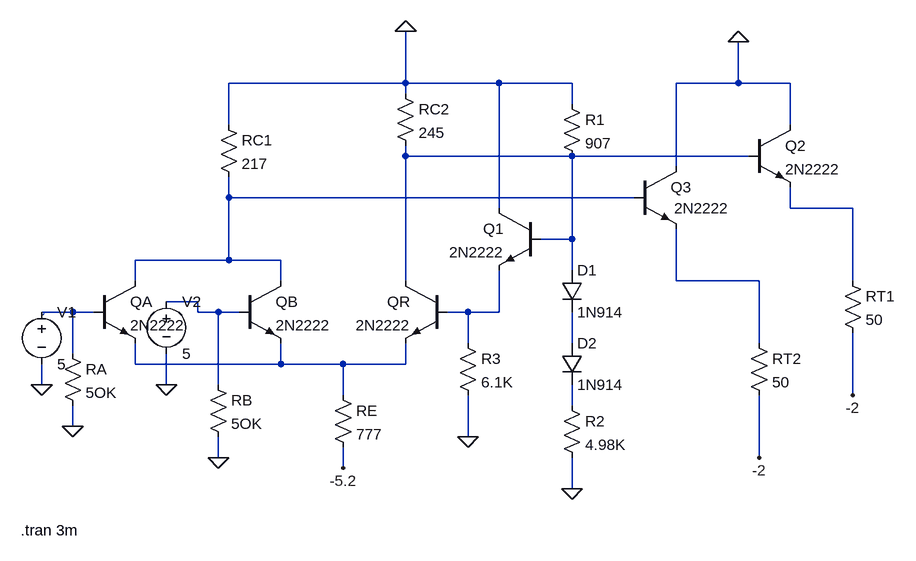
[diagram p0: schematic ECL22.asc]
ECL22.asc, the LTspice schematic file:
Version 4
SHEET 1 980 736
WIRE 192 32 192 -48
WIRE 192 32 -80 32
WIRE 336 32 192 32
WIRE 448 32 336 32
WIRE 704 32 704 -32
WIRE 704 32 608 32
WIRE 784 32 704 32
WIRE 192 48 192 32
WIRE 448 64 448 32
WIRE -80 96 -80 32
WIRE 784 96 784 32
WIRE 192 144 192 128
WIRE 448 144 192 144
WIRE 720 144 448 144
WIRE 608 160 608 32
WIRE -80 208 -80 176
WIRE 544 208 -80 208
WIRE 336 224 336 32
WIRE 784 224 784 192
WIRE 880 224 784 224
WIRE 448 272 448 144
WIRE 448 272 400 272
WIRE -80 304 -80 208
WIRE -80 304 -224 304
WIRE 0 304 -80 304
WIRE 448 320 448 272
WIRE -224 336 -224 304
WIRE 0 336 0 304
WIRE 192 336 192 144
WIRE 608 336 608 256
WIRE 736 336 608 336
WIRE 880 336 880 224
WIRE -128 368 -176 368
WIRE -320 384 -368 384
WIRE -288 384 -320 384
WIRE -128 384 -128 368
WIRE -96 384 -128 384
WIRE -64 384 -96 384
WIRE 288 384 256 384
WIRE 336 384 336 320
WIRE 336 384 288 384
WIRE 288 432 288 384
WIRE 448 432 448 384
WIRE 736 432 736 336
WIRE -320 448 -320 384
WIRE -224 464 -224 432
WIRE 0 464 0 432
WIRE 0 464 -224 464
WIRE 96 464 0 464
WIRE 192 464 192 432
WIRE 192 464 96 464
WIRE -368 496 -368 464
WIRE -176 496 -176 448
WIRE -96 496 -96 384
WIRE 96 512 96 464
WIRE 880 512 880 416
WIRE 448 528 448 496
WIRE -320 560 -320 528
WIRE 288 576 288 512
WIRE -96 608 -96 576
WIRE 736 608 736 512
WIRE 96 624 96 592
WIRE 448 656 448 608
FLAG 448 656 0
FLAG 736 608 -2
FLAG 880 512 -2
FLAG 288 576 0
FLAG 96 624 -5.2
FLAG -96 608 0
FLAG -320 560 0
FLAG 192 -48 0
FLAG 704 -32 0
FLAG -368 496 0
FLAG -176 496 0
SYMBOL diode 432 320 R0
SYMATTR InstName D1
SYMATTR Value 1N914
SYMBOL diode 432 432 R0
SYMATTR InstName D2
SYMATTR Value 1N914
SYMBOL res 432 512 R0
SYMATTR InstName R2
SYMATTR Value 4.98K
SYMBOL res 432 48 R0
SYMATTR InstName R1
SYMATTR Value 907
SYMBOL npn 544 160 R0
WINDOW 3 61 64 Left 2
SYMATTR Value 2N2222
SYMATTR InstName Q3
SYMBOL npn 720 96 R0
SYMATTR InstName Q2
SYMATTR Value 2N2222
SYMBOL npn -288 336 R0
SYMATTR InstName QA
SYMATTR Value 2N2222
SYMBOL npn -64 336 R0
SYMATTR InstName QB
SYMATTR Value 2N2222
SYMBOL npn 256 336 M0
SYMATTR InstName QR
SYMATTR Value 2N2222
SYMBOL npn 400 224 M0
SYMATTR InstName Q1
SYMATTR Value 2N2222
SYMBOL res 80 496 R0
SYMATTR InstName RE
SYMATTR Value 777
SYMBOL res -112 480 R0
SYMATTR InstName RB
SYMATTR Value 5OK
SYMBOL res -336 432 R0
SYMATTR InstName RA
SYMATTR Value 5OK
SYMBOL res -96 80 R0
SYMATTR InstName RC1
SYMATTR Value 217
SYMBOL res 176 32 R0
SYMATTR InstName RC2
SYMATTR Value 245
SYMBOL res 720 416 R0
SYMATTR InstName RT2
SYMATTR Value 50
SYMBOL res 864 320 R0
SYMATTR InstName RT1
SYMATTR Value 50
SYMBOL res 272 416 R0
SYMATTR InstName R3
SYMATTR Value 6.1K
SYMBOL voltage -368 368 R0
WINDOW 123 0 0 Left 0
WINDOW 39 0 0 Left 0
SYMATTR InstName V1
SYMATTR Value 5
SYMBOL voltage -176 352 R0
WINDOW 123 0 0 Left 0
WINDOW 39 0 0 Left 0
SYMATTR InstName V2
SYMATTR Value 5
TEXT -400 720 Left 2 !.tran 3m
ARC Normal -368 384 -364 388 -368 388 -368 384 2

The netlist it stands for:
* ECL22.asc
D1 N001 N008 1N914
D2 N008 N010 1N914
R2 N010 0 4.98K
R1 0 N001 907
Q3 0 N002 N004 0 2N2222
Q2 0 N001 N003 0 2N2222
QA N002 N006 N009 0 2N2222
QB N002 N005 N009 0 2N2222
QR N001 N007 N009 0 2N2222
Q1 0 N001 N007 0 2N2222
RE N009 -5.2 777
RB N005 0 5OK
RA N006 0 5OK
RC1 0 N002 217
RC2 0 N001 245
RT2 N004 -2 50
RT1 N003 -2 50
R3 N007 0 6.1K
V1 N006 0 5
V2 N005 0 5
.model D D
.lib standard.dio
.model NPN NPN
.model PNP PNP
.lib standard.bjt
.tran 3m
.backanno
.end